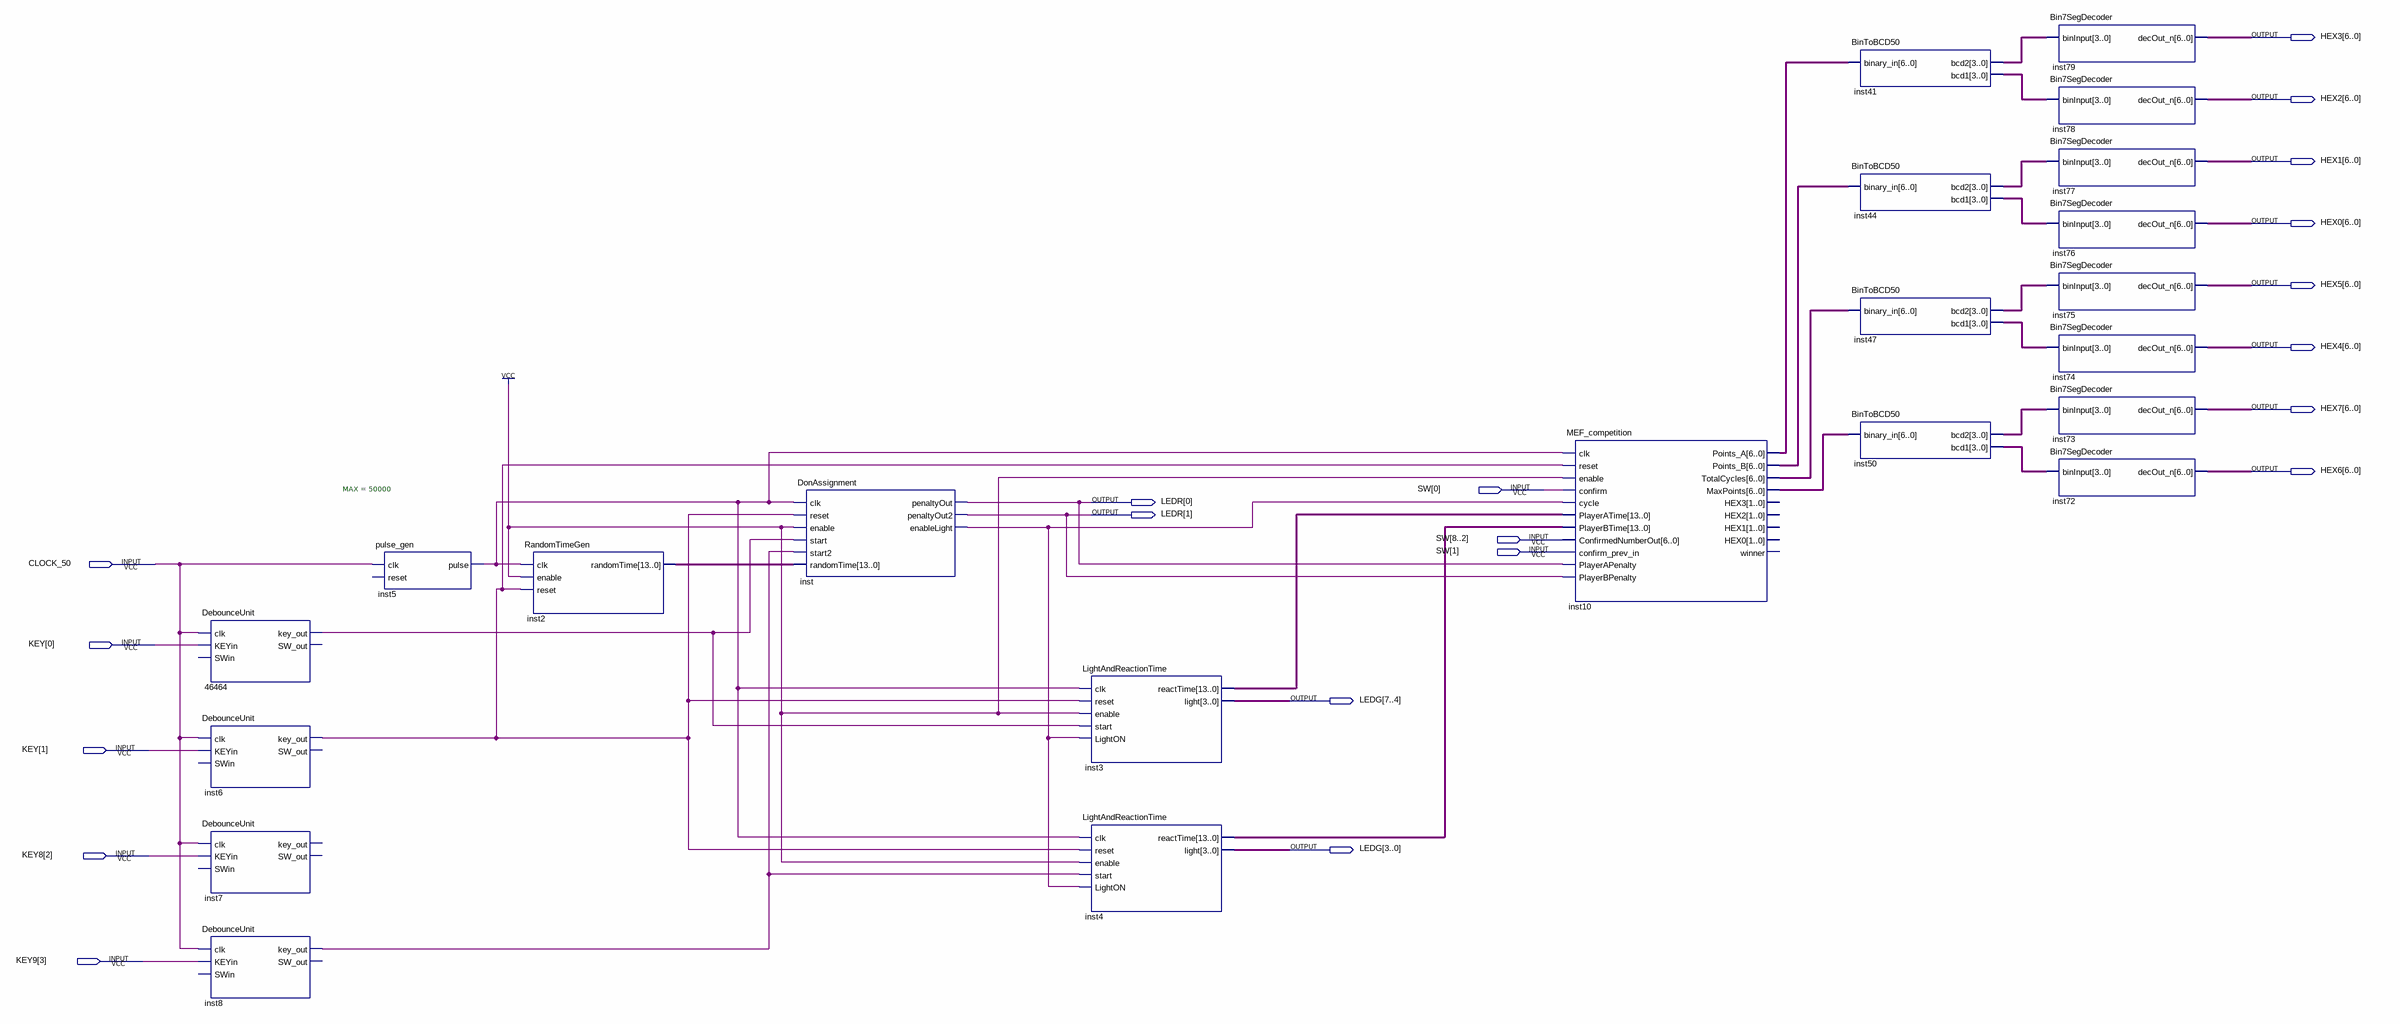
[diagram p0: schematic sheet]
// Quartus schematic TesteElementar.bdf as structural Verilog: 22 symbols, 20 pins
module TesteElementar (
  input  [8:0] SW,
  input  CLOCK_50,
  input  [1:0] KEY,
  input  [2:2] KEY8,
  input  [3:3] KEY9,
  output [6:0] HEX3,
  output [6:0] HEX2,
  output [6:0] HEX1,
  output [6:0] HEX0,
  output [6:0] HEX5,
  output [6:0] HEX4,
  output [6:0] HEX7,
  output [6:0] HEX6,
  output [1:0] LEDR,
  output [7:0] LEDG
);

  wire inst5_pulse, inst6_key_out, inst8_key_out, inst_enablelight, n46464_key_out;
  wire [3:0] inst41_bcd1, inst41_bcd2, inst44_bcd1, inst44_bcd2, inst47_bcd1, inst47_bcd2, inst50_bcd1,
       inst50_bcd2;
  wire [6:0] inst10_maxpoints, inst10_points_a, inst10_points_b, inst10_totalcycles;
  wire [13:0] inst2_randomtime, inst3_reacttime, inst4_reacttime;

  DebounceUnit u_46464 (.clk(CLOCK_50), .KEYin(KEY[0]), .key_out(n46464_key_out));  // open: SWin, SW_out
  DebounceUnit inst6 (.clk(CLOCK_50), .KEYin(KEY[1]), .key_out(inst6_key_out));  // open: SWin, SW_out
  DebounceUnit inst7 (.clk(CLOCK_50), .KEYin(KEY8[2]));  // open: SWin, key_out, SW_out
  DebounceUnit inst8 (.clk(CLOCK_50), .KEYin(KEY9[3]), .key_out(inst8_key_out));  // open: SWin, SW_out
  pulse_gen #(.MAX(50000)) inst5 (.clk(CLOCK_50), .pulse(inst5_pulse));  // open: reset
  RandomTimeGen inst2 (.clk(inst5_pulse), .enable(1'b1), .reset(inst6_key_out), .randomTime(inst2_randomtime));
  DonAssignment inst (
    .clk(inst5_pulse), .reset(inst6_key_out), .enable(1'b1), .start(n46464_key_out), .start2(inst8_key_out),
    .randomTime(inst2_randomtime), .penaltyOut(LEDR[0]), .penaltyOut2(LEDR[1]), .enableLight(inst_enablelight));
  LightAndReactionTime inst3 (
    .clk(inst5_pulse), .reset(inst6_key_out), .enable(1'b1), .start(n46464_key_out),
    .LightON(inst_enablelight), .reactTime(inst3_reacttime), .light(LEDG[7:4]));
  LightAndReactionTime inst4 (
    .clk(inst5_pulse), .reset(inst6_key_out), .enable(1'b1), .start(inst8_key_out),
    .LightON(inst_enablelight), .reactTime(inst4_reacttime), .light(LEDG[3:0]));
  MEF_competition inst10 (
    .clk(inst5_pulse), .reset(inst6_key_out), .enable(1'b1), .confirm(SW[0]), .cycle(inst_enablelight),
    .PlayerATime(inst3_reacttime), .PlayerBTime(inst4_reacttime), .ConfirmedNumberOut(SW[8:2]),
    .confirm_prev_in(SW[1]), .PlayerAPenalty(LEDR[0]), .PlayerBPenalty(LEDR[1]), .Points_A(inst10_points_a),
    .Points_B(inst10_points_b), .TotalCycles(inst10_totalcycles), .MaxPoints(inst10_maxpoints));  // open: HEX3, HEX2, HEX1, HEX0, winner
  BinToBCD50 inst41 (.binary_in(inst10_points_a), .bcd2(inst41_bcd2), .bcd1(inst41_bcd1));
  BinToBCD50 inst44 (.binary_in(inst10_points_b), .bcd2(inst44_bcd2), .bcd1(inst44_bcd1));
  BinToBCD50 inst47 (.binary_in(inst10_totalcycles), .bcd2(inst47_bcd2), .bcd1(inst47_bcd1));
  BinToBCD50 inst50 (.binary_in(inst10_maxpoints), .bcd2(inst50_bcd2), .bcd1(inst50_bcd1));
  Bin7SegDecoder inst79 (.binInput(inst41_bcd2), .decOut_n(HEX3));
  Bin7SegDecoder inst78 (.binInput(inst41_bcd1), .decOut_n(HEX2));
  Bin7SegDecoder inst77 (.binInput(inst44_bcd2), .decOut_n(HEX1));
  Bin7SegDecoder inst76 (.binInput(inst44_bcd1), .decOut_n(HEX0));
  Bin7SegDecoder inst75 (.binInput(inst47_bcd2), .decOut_n(HEX5));
  Bin7SegDecoder inst74 (.binInput(inst47_bcd1), .decOut_n(HEX4));
  Bin7SegDecoder inst73 (.binInput(inst50_bcd2), .decOut_n(HEX7));
  Bin7SegDecoder inst72 (.binInput(inst50_bcd1), .decOut_n(HEX6));
endmodule
